# EAGLE schematic main (EAGLE 6.5.0)
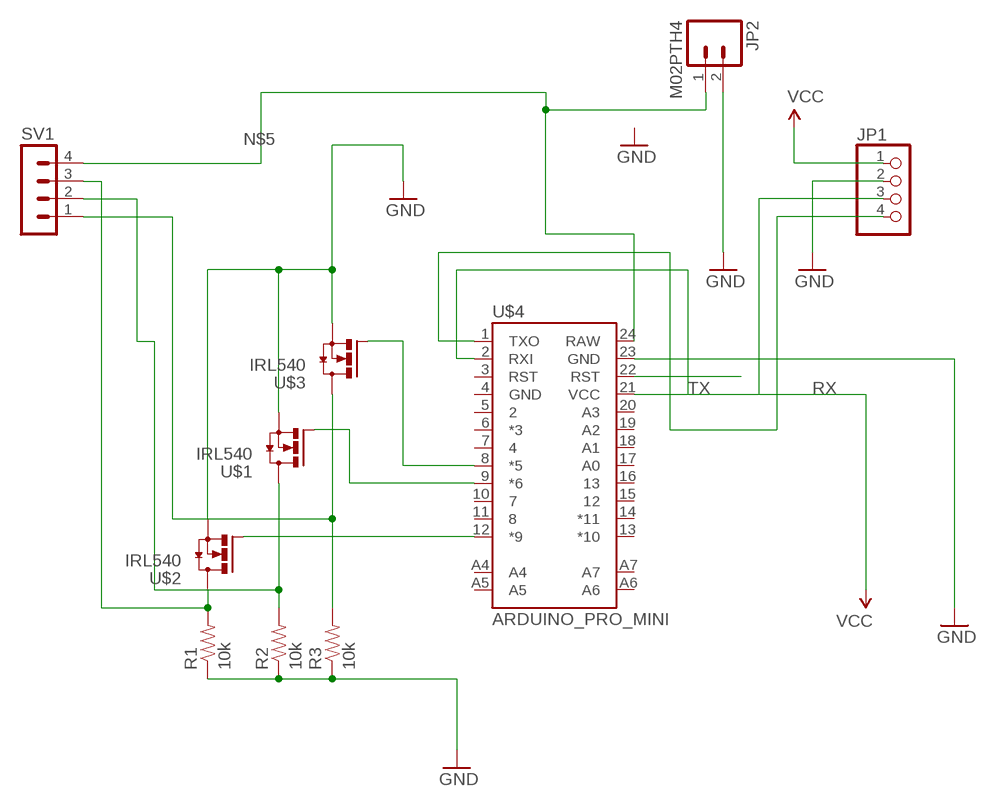
[diagram p0: schematic, sheet 1]

## Parts
JP1  PINHD-1X4  [1X04]
JP2  M02PTH4  [1X02_XTRA_BIG]
R1  10k  RESISTORPTH-1/4W  [AXIAL-0.4]
R2  10k  RESISTORPTH-1/4W  [AXIAL-0.4]
R3  10k  RESISTORPTH-1/4W  [AXIAL-0.4]
SV1  MA04-1  [MA04-1]
U$1  IRL540  [TO220AH]
U$2  IRL540  [TO220AH]
U$3  IRL540  [TO220AH]
U$4  ARDUINO_PRO_MINI  [ARDUINO_PRO_MINI]

## Nets
GND: JP1.2 JP2.2 R1.P$1 R2.P$1 R3.P$1 U$1.E(S) U$2.E(S) U$3.E(S) U$4.23(GND)
N$2: U$3.B(G) U$4.8(*5)
N$3: U$1.B(G) U$4.9(*6)
N$4: U$2.B(G) U$4.12(*9)
N$5: JP2.1 SV1.4 U$4.24(RAW)
N$6: R3.P$2 SV1.1 U$3.C(D)
N$7: U$4.22(RST)
N$8: R1.P$2 SV1.3 U$2.C(D)
N$9: R2.P$2 SV1.2 U$1.C(D)
RX: JP1.4 U$4.1(TXO)
TX: JP1.3 U$4.2(RXI)
VCC: JP1.1 U$4.21(VCC)
Unconnected: U$4.3(RST) U$4.4(GND) U$4.5 U$4.6(*3) U$4.7 U$4.10 U$4.11 U$4.13(*10) U$4.14(*11) U$4.15 U$4.16 U$4.17(A0) U$4.18(A1) U$4.19(A2) U$4.20(A3) U$4.A4 U$4.A5 U$4.A6 U$4.A7

## Library data of the parts
JP1 = pinhead:PINHD-1X4: PIN HEADER
JP2 = SparkFun-Connectors:M02: Standard 2-pin 0.1" header. Use with - straight break away headers ( PRT-00116) - right angle break away headers (PRT-00553) - swiss pins (PRT-00743) - machine pins (PRT-00117) - female headers (PRT-00115) Molex polarized connector foot print use with: PRT-08233 with associated crimp pins and housings. 2.54_SCREWTERM for use with PRT-10571. 3.5mm Screw Terminal footprints for PRT-08084 5mm Screw Terminal footprints for use with PRT-08432
R1-R3 = SparkFun-Resistors:RESISTOR: Resistor Basic schematic elements and footprints for 0603, 1206, and PTH resistors.
SV1 = con-lstb:MA04-1: PIN HEADER; OC_FARNELL: unknown; OC_NEWARK: unknown
U$1-U$3 = transistor-power:IRL540
U$4 = SparkFun-Boards:ARDUINO_PRO_MINI